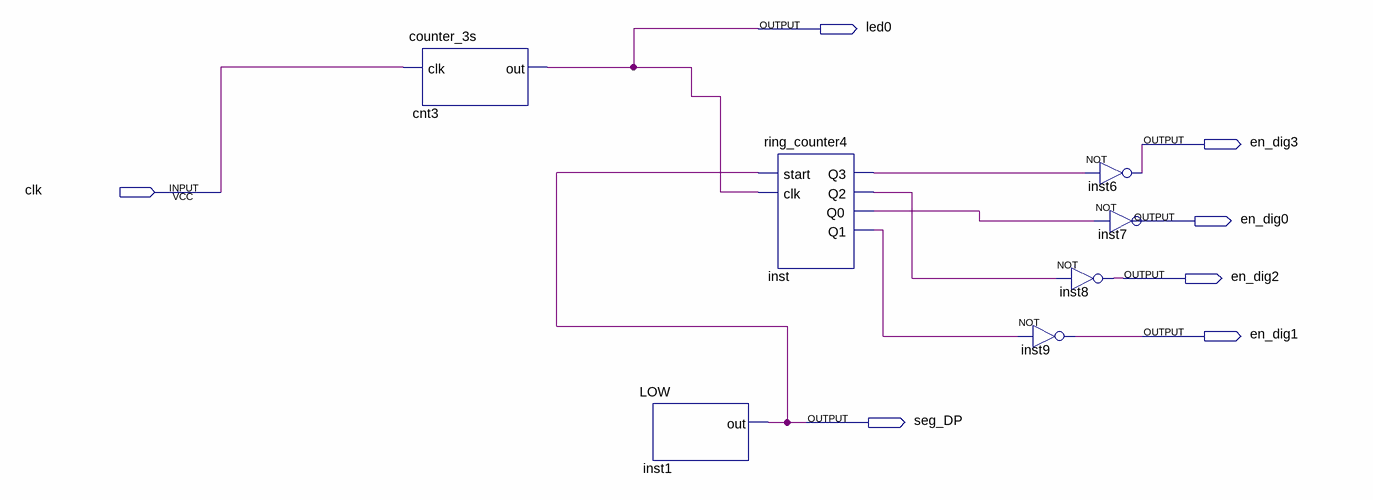
[diagram p0: schematic sheet]
// Quartus schematic test_ring_counter4.bdf as structural Verilog: 7 symbols, 7 pins
module test_ring_counter4 (
  input  clk,
  output led0,
  output en_dig3,
  output en_dig0,
  output en_dig2,
  output en_dig1,
  output seg_DP
);

  wire inst_q0, inst_q1, inst_q2, inst_q3;

  counter_3s cnt3 (.clk(clk), .out(led0));
  LOW inst1 (.out(seg_DP));
  ring_counter4 inst (.start(seg_DP), .clk(led0), .Q3(inst_q3), .Q2(inst_q2), .Q0(inst_q0), .Q1(inst_q1));
  not inst9 (en_dig1, inst_q1);
  not inst6 (en_dig3, inst_q3);
  not inst7 (en_dig0, inst_q0);
  not inst8 (en_dig2, inst_q2);
endmodule
